# EasyEDA Pro project RG3205W-EDLer.epro

# Schematic RG3205W-EDLer
Board Name: Board1; Create Date: 2025-11-01; Page Name: P1; Project Name: RG3205W-EDL; Schematic Name: Schematic1; Update Date: 2025-11-02; Company: EasyEDA.com; Page Size: A4; Version: V1.0
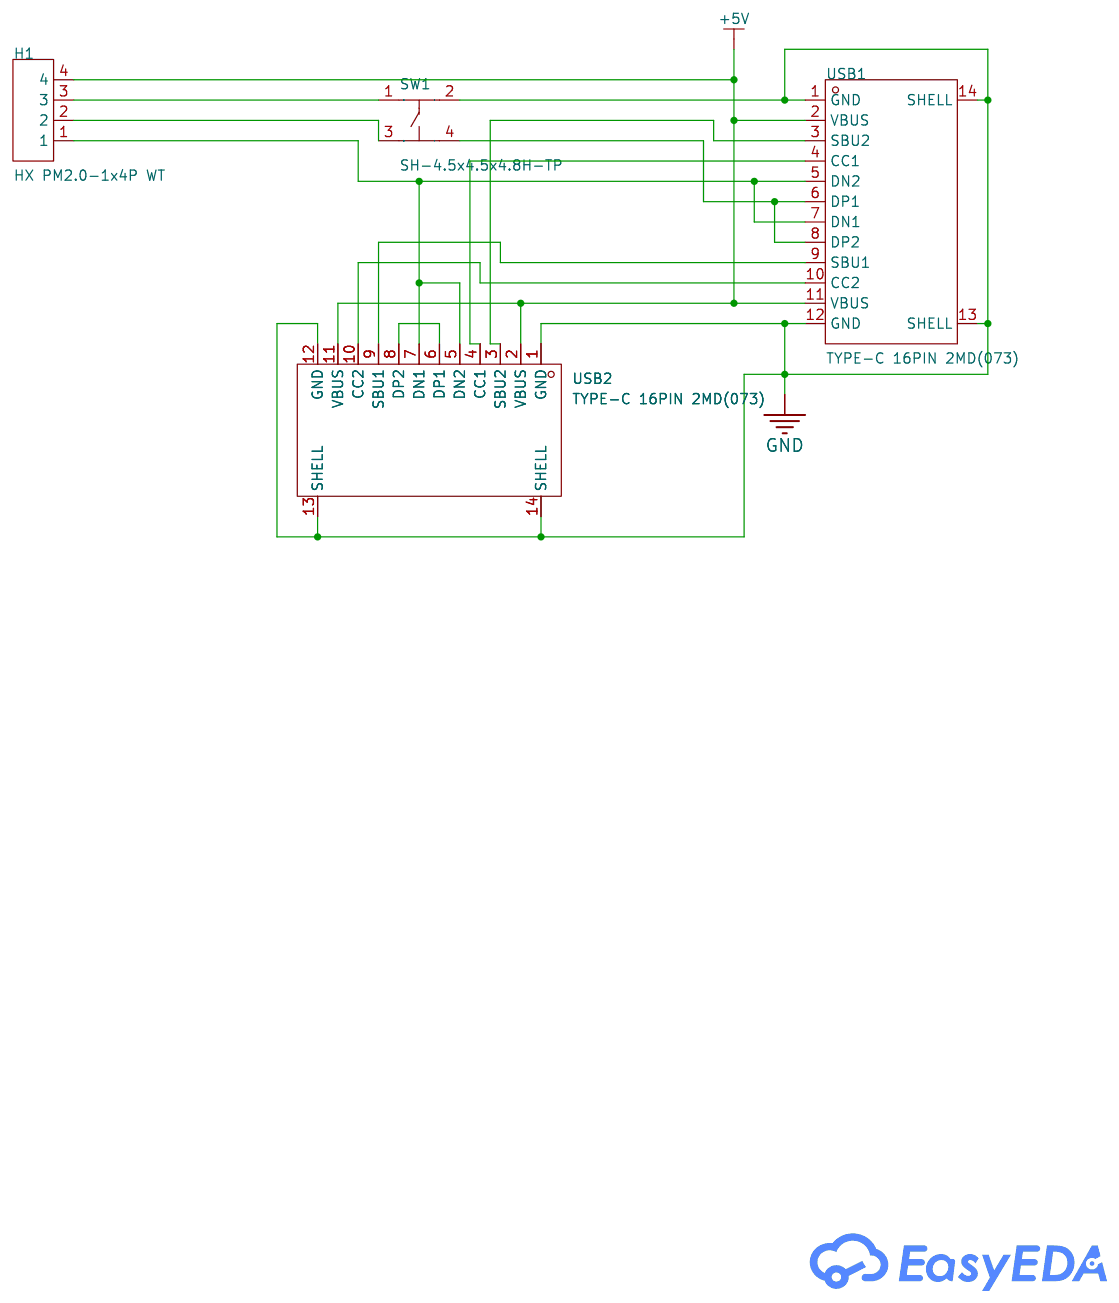
[diagram p0: schematic sheet]

## Parts
H1  HX PM2.0-1x4P WT  [HDR-SMD_4P-P2.00_HXPM2.0-1X4PWT]
SW1  SH-4.5x4.5x4.8H-TP  [SW-SMD_4P-L4.5-W4.5-P3.00-LS6.9]
USB1  TYPE-C 16PIN 2MD(073)  [USB-C-SMD_TYPE-C-6PIN-2MD-073]
USB2  TYPE-C 16PIN 2MD(073)  [USB-C-SMD_TYPE-C-6PIN-2MD-073]

## Library data of the parts
H1 = HX PM2.0-1x4P WT: Holes Structure:1x4P Pitch:2mm Row Spacing:- Circular Hole / Square Hole:Square Hole Mounting Type:Surface Mount, Right Angle Number of Rows:1 Number of Positions:4P Current Rating:1.5A Voltage Rating (Max):500V Holes Direction:Top Insulation Height:6.35m; LCSC Part Name: 配套排针：HX PZ2.0-1x4P系列 1x4P 间距:2mm 卧贴; Supplier Part: C46061754; Manufacturer: hanxia(韩下); Supplier Footprint: SMD,P=2mm,卧贴; JLCPCB Part Class: Extended Part; Datasheet: https://item.szlcsc.com/datasheet/HX%2520PM2.0-1x4P%2520WT/48170614.html; Supplier: LCSC; Holes Structure: 1x4P; Pitch: 2mm; Circular Hole / Square Hole: Square Hole; Mounting Type: Surface Mount, Right Angle; Number of Rows: 1; Number of Positions: 4P; Current Rating: 1.5A; Voltage Rating (Max): 500V; Holes Direction: Top; Insulation Height: 6.35mm; Contact Material: Brass; Contact Plating: Gold; Operating Temperature: -40℃~+105℃; PIN Length: 2.8mm
SW1 = SH-4.5x4.5x4.8H-TP: LCSC Part Name: 4.5*4.5*3.8/4.5x4.5x3.8mm 轻触开关; Supplier Part: C52092032; Manufacturer: SHOU HAN(首韩); Supplier Footprint: SMD; JLCPCB Part Class: Extended Part; Datasheet: https://item.szlcsc.com/datasheet/SH-4.5x4.5x4.8H-TP/54864056.html; Supplier: LCSC
USB1 USB2 = TYPE-C 16PIN 2MD(073): Connector Type:Type-C Protocol Standard:- Gender:Female Mounting Type:Surface Mount, Right Angle Number of Contacts:16P Number of Ports:1 Current Rating-Power:3A Voltage Rating:5V Connect-Disconnect Life:5,000 Cycles Supplementary Features:- Center Height; LCSC Part Name: Type-C 母 卧贴; Supplier Part: C2765186; Manufacturer: SHOU HAN(首韩); Supplier Footprint: SMD; JLCPCB Part Class: Extended Part; Datasheet: https://item.szlcsc.com/datasheet/TYPE-C%252016PIN%25202MD(073)/2901843.html; Supplier: LCSC; Connector Type: Type-C; Gender: Female; Mounting Type: Surface Mount, Right Angle; Number of Contacts: 16P; Number of Ports: 1; Current Rating-Power: 3A; Voltage Rating: 5V; Connect-Disconnect Life: 5,000 Cycles; Detection color: Black; Operating Temperature: -25℃~+85℃

## Nets
+5V: H1.4 USB1.2(VBUS) USB1.11(VBUS) USB2.2(VBUS) USB2.11(VBUS)
GND: SW1.2 USB1.1(GND) USB1.12(GND) USB1.13(SHELL) USB1.14(SHELL) USB2.1(GND) USB2.12(GND) USB2.13(SHELL) USB2.14(SHELL)
$1N1127: USB1.10(CC2) USB2.10(CC2)
$1N1138: USB1.9(SBU1) USB2.9(SBU1)
$1N1163: USB1.4(CC1) USB2.4(CC1)
$1N1185: USB1.3(SBU2) USB2.3(SBU2)
$1N1297: H1.1 USB1.5(DN2) USB1.7(DN1) USB2.5(DN2) USB2.7(DN1)
$1N1394: H1.3 SW1.1
$1N1398: H1.2 SW1.3
Net-(SW1-4): SW1.4 USB1.6(DP1) USB1.8(DP2)
Net-(USB2-6): USB2.6(DP1) USB2.8(DP2)

# Board PCB1
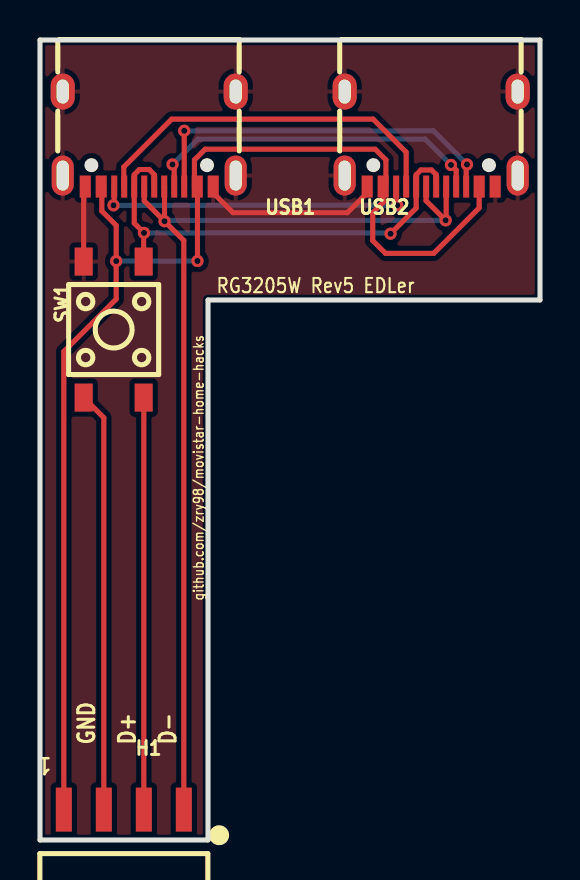
[diagram p1: board, top side]
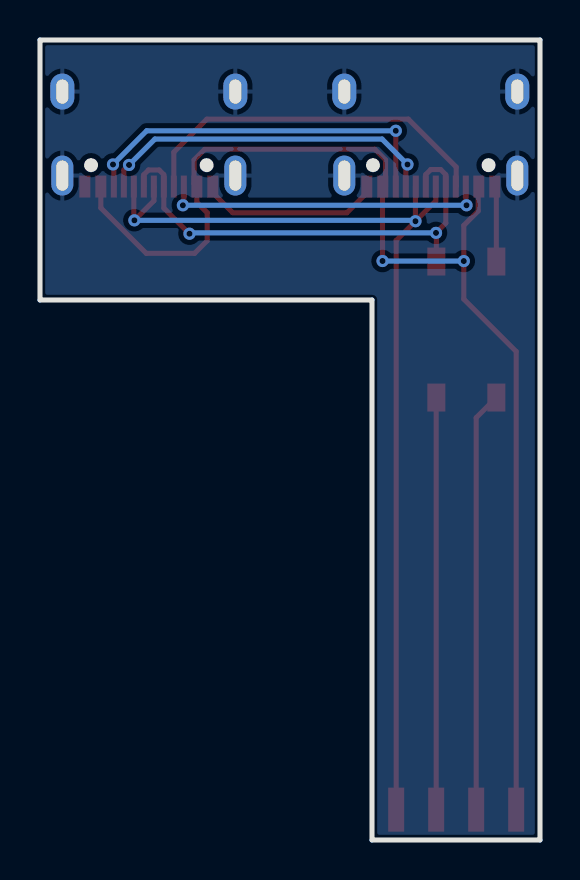
[diagram p2: board, bottom side, seen from below]

Outline 25 x 40 mm; copper layers: Top Layer, Bottom Layer. Coordinates in mm from the lower left corner of the outline.
Outline path: 0,40 0,0 8.4,0 8.4,27 25,27 25,40 0,40
Stack: Top Layer 0.035mm / Dielectric1 1.51mm FR4 er 4.5 / Bottom Layer 0.035mm

## Design rules (mm)
net GND: GND
net +5V: VCC
net $1N1185: USB_CC
net $1N1163: USB_SBU
net $1N1138: USB_SBU
net $1N1127: USB_CC
net $1N1297: USB_DN
net $1N1287: USB_DP
template: JLCPCB Capability(Two Layers Board)
spacing copperThickness1oz (default): track to track 0.102, other pairs 0.152 to 0.3
spacing copperThickness2oz: track to track 0.203, other pairs 0.152 to 0.3
track width copperThickness1oz (default): min 0.127, default 0.254, max 2.54
track width copperThickness2oz: min 0.203, default 0.254, max 2.54
differential pair differentialPair (default): width min 0.127, default 0.254, max 2.54; gap min 0.152, default 0.152
via viaSize (default): diameter min 0.5, default 0.61, max 10; hole min 0.3, default 0.305, max 6.3

## Placement (name value [footprint] x y rotation side)
H1  HX PM2.0-1x4P WT  [HDR-SMD_4P-P2.00_HXPM2.0-1X4PWT]  4.19 1.52 180 top
SW1  SH-4.5x4.5x4.8H-TP  [SW-SMD_4P-L4.5-W4.5-P3.00-LS6.9]  3.68 25.52 90 top
USB1  TYPE-C 16PIN 2MD(073)  [USB-C-SMD_TYPE-C-6PIN-2MD-073]  5.46 35.05 180 top
USB2  TYPE-C 16PIN 2MD(073)  [USB-C-SMD_TYPE-C-6PIN-2MD-073]  19.56 35.05 180 top

## Footprints (pads in the part's own frame, mm; a bottom-side part is the same pattern mirrored in y, then rotated)
HDR-SMD_4P-P2.00_HXPM2.0-1X4PWT
  rect 0.8x2.2 smd: 1(-3,0) 2(-1,0) 3(1,0) 4(3,0)
SW-SMD_4P-L4.5-W4.5-P3.00-LS6.9
  rect 1.4x0.9 smd: 1(-3.4,1.5) 2(3.4,1.5) 3(-3.4,-1.5) 4(3.4,-1.5)
USB-C-SMD_TYPE-C-6PIN-2MD-073
  rect 0.55x1.1 smd: 1(-3.2,2.375) 2(-2.4,2.375) 11(2.4,2.375) 12(3.2,2.375)
  rect 0.3x1.1 smd: 3(-1.75,2.375) 4(-1.25,2.375) 5(-0.75,2.375) 6(-0.25,2.375) 7(0.25,2.375) 8(0.75,2.375) 9(1.25,2.375) 10(1.75,2.375)
  oval 1.1x2 hole 0.6x1.5: 13(-4.325,1.825) 14(4.325,1.825)
  oval 1.2x1.8 hole 0.6x1.2: 13(-4.325,-2.375) 14(4.325,-2.375)

## Nets
As in the schematic, except:
$1N1287: SW1.4 USB1.6 USB1.8 USB2.6 USB2.8

## Via types
v1: diameter 0.61, hole 0.305, Top Layer to Bottom Layer, 12 vias

## Routing (per net, layer and track width the routed paths; a pad name or vN(x,y) marks a point on that pad's centre or on a via; arc(x,y) is an arc through that point)
+5V: length 63.7
  Top Layer w0.254: H1.4 1.19,24.43 3.81,27.05 v1(3.81,28.95) 3.81,30.73 3.09,31.45 3.09,32.64 USB1.11 ; USB2.2 21.96,31.61 19.69,29.33 17.27,29.33 16.64,29.97 16.64,31.36 17.16,31.89 USB2.11 17.3,32.81 17.3,34 16.76,34.54 8.26,34.54 7.72,34 7.72,32.67 7.86,32.67 7.87,32.66 v1(7.87,28.95)
  Bottom Layer w0.254: v1(3.81,28.95) 7.87,28.95 v1(7.87,28.95)
GND: length 12.7
  Top Layer w0.254: USB2.12 16.36,32.36 15.37,31.36 9.65,31.36 8.66,32.36 USB1.1 ; 2.18,29.18 2.18,32.59 2.26,32.67
$1N1127: length 16.1
  Top Layer w0.254: v1(3.67,31.74) 3.71,31.77 USB1.10 ; v1(17.86,31.74) 17.81,31.78 USB2.10
  Bottom Layer w0.254: v1(17.86,31.74) v1(3.67,31.74)
$1N1138: length 18.5
  Top Layer w0.254: USB2.9 18.31,34.39 16.66,36.04 6.59,36.04 4.19,33.65 4.19,32.69 USB1.9
$1N1163: length 17.3
  Top Layer w0.254: v1(20.55,33.75) 20.81,33.49 USB2.4 ; v1(6.63,33.78) 6.71,33.69 USB1.4
  Bottom Layer w0.254: v1(20.55,33.75) 19.25,35.05 7.9,35.05 v1(6.63,33.78)
$1N1185: length 18.7
  Top Layer w0.254: v1(7.21,35.46) USB1.3 ; USB2.3 21.31,33.73 v1(21.35,33.78)
  Bottom Layer w0.254: v1(7.21,35.46) 19.67,35.46 v1(21.35,33.78)
$1N1287: length 24
  Top Layer w0.254: USB2.6 19.81,32.68 19.81,33.26 19.57,33.5 19.04,33.5 18.81,33.27 USB2.8 18.81,31.6 v1(17.53,30.31) ; USB1.6 5.71,33.27 5.46,33.52 4.97,33.52 4.71,33.27 USB1.8 4.71,30.84 v1(5.2,30.36) 5.18,30.34 SW1.4
  Bottom Layer w0.254: v1(5.2,30.36) 17.48,30.36 v1(17.53,30.31)
$1N1297: length 51.6
  Top Layer w0.254: v1(6.23,30.94) 5.21,31.96 USB1.7 ; v1(6.23,30.94) 6.23,32.66 USB1.5 ; v1(6.23,30.94) 7.19,29.98 H1.1 ; USB2.7 19.3,32.67 19.3,31.96 v1(20.28,30.98) 20.31,31.01 USB2.5
  Bottom Layer w0.254: v1(20.28,30.98) 6.27,30.98 v1(6.23,30.94)
$1N1394: length 21
  Top Layer w0.254: SW1.1 3.19,21.11 H1.3
$1N1398: length 20.6
  Top Layer w0.254: H1.2 5.19,22.11 SW1.3

## Copper pours and planes (outline as drawn; the poured copper is in the pictures)
GND on Top Layer: 0,40 25,40 25,0 0,0
GND on Bottom Layer: 0,40 25,40 25,0 0,0

## Text on the board
Top Silkscreen Layer: github.com/zry98/movistar-home-hacks | RG3205W Rev5 EDLer | 1 | GND | D+ | D-
